# Altium schematic sheet pca10112_sheet2_nrf52840_mcu.SchDoc: nRF52840 MCU
size A3; Organization: Nordic Semiconductor; DocumentNumber: 2; SheetNumber: 2; SheetTotal: 7; CompanyName: Nordic Semiconductor; ProjectName: pca10112.PrjPCB
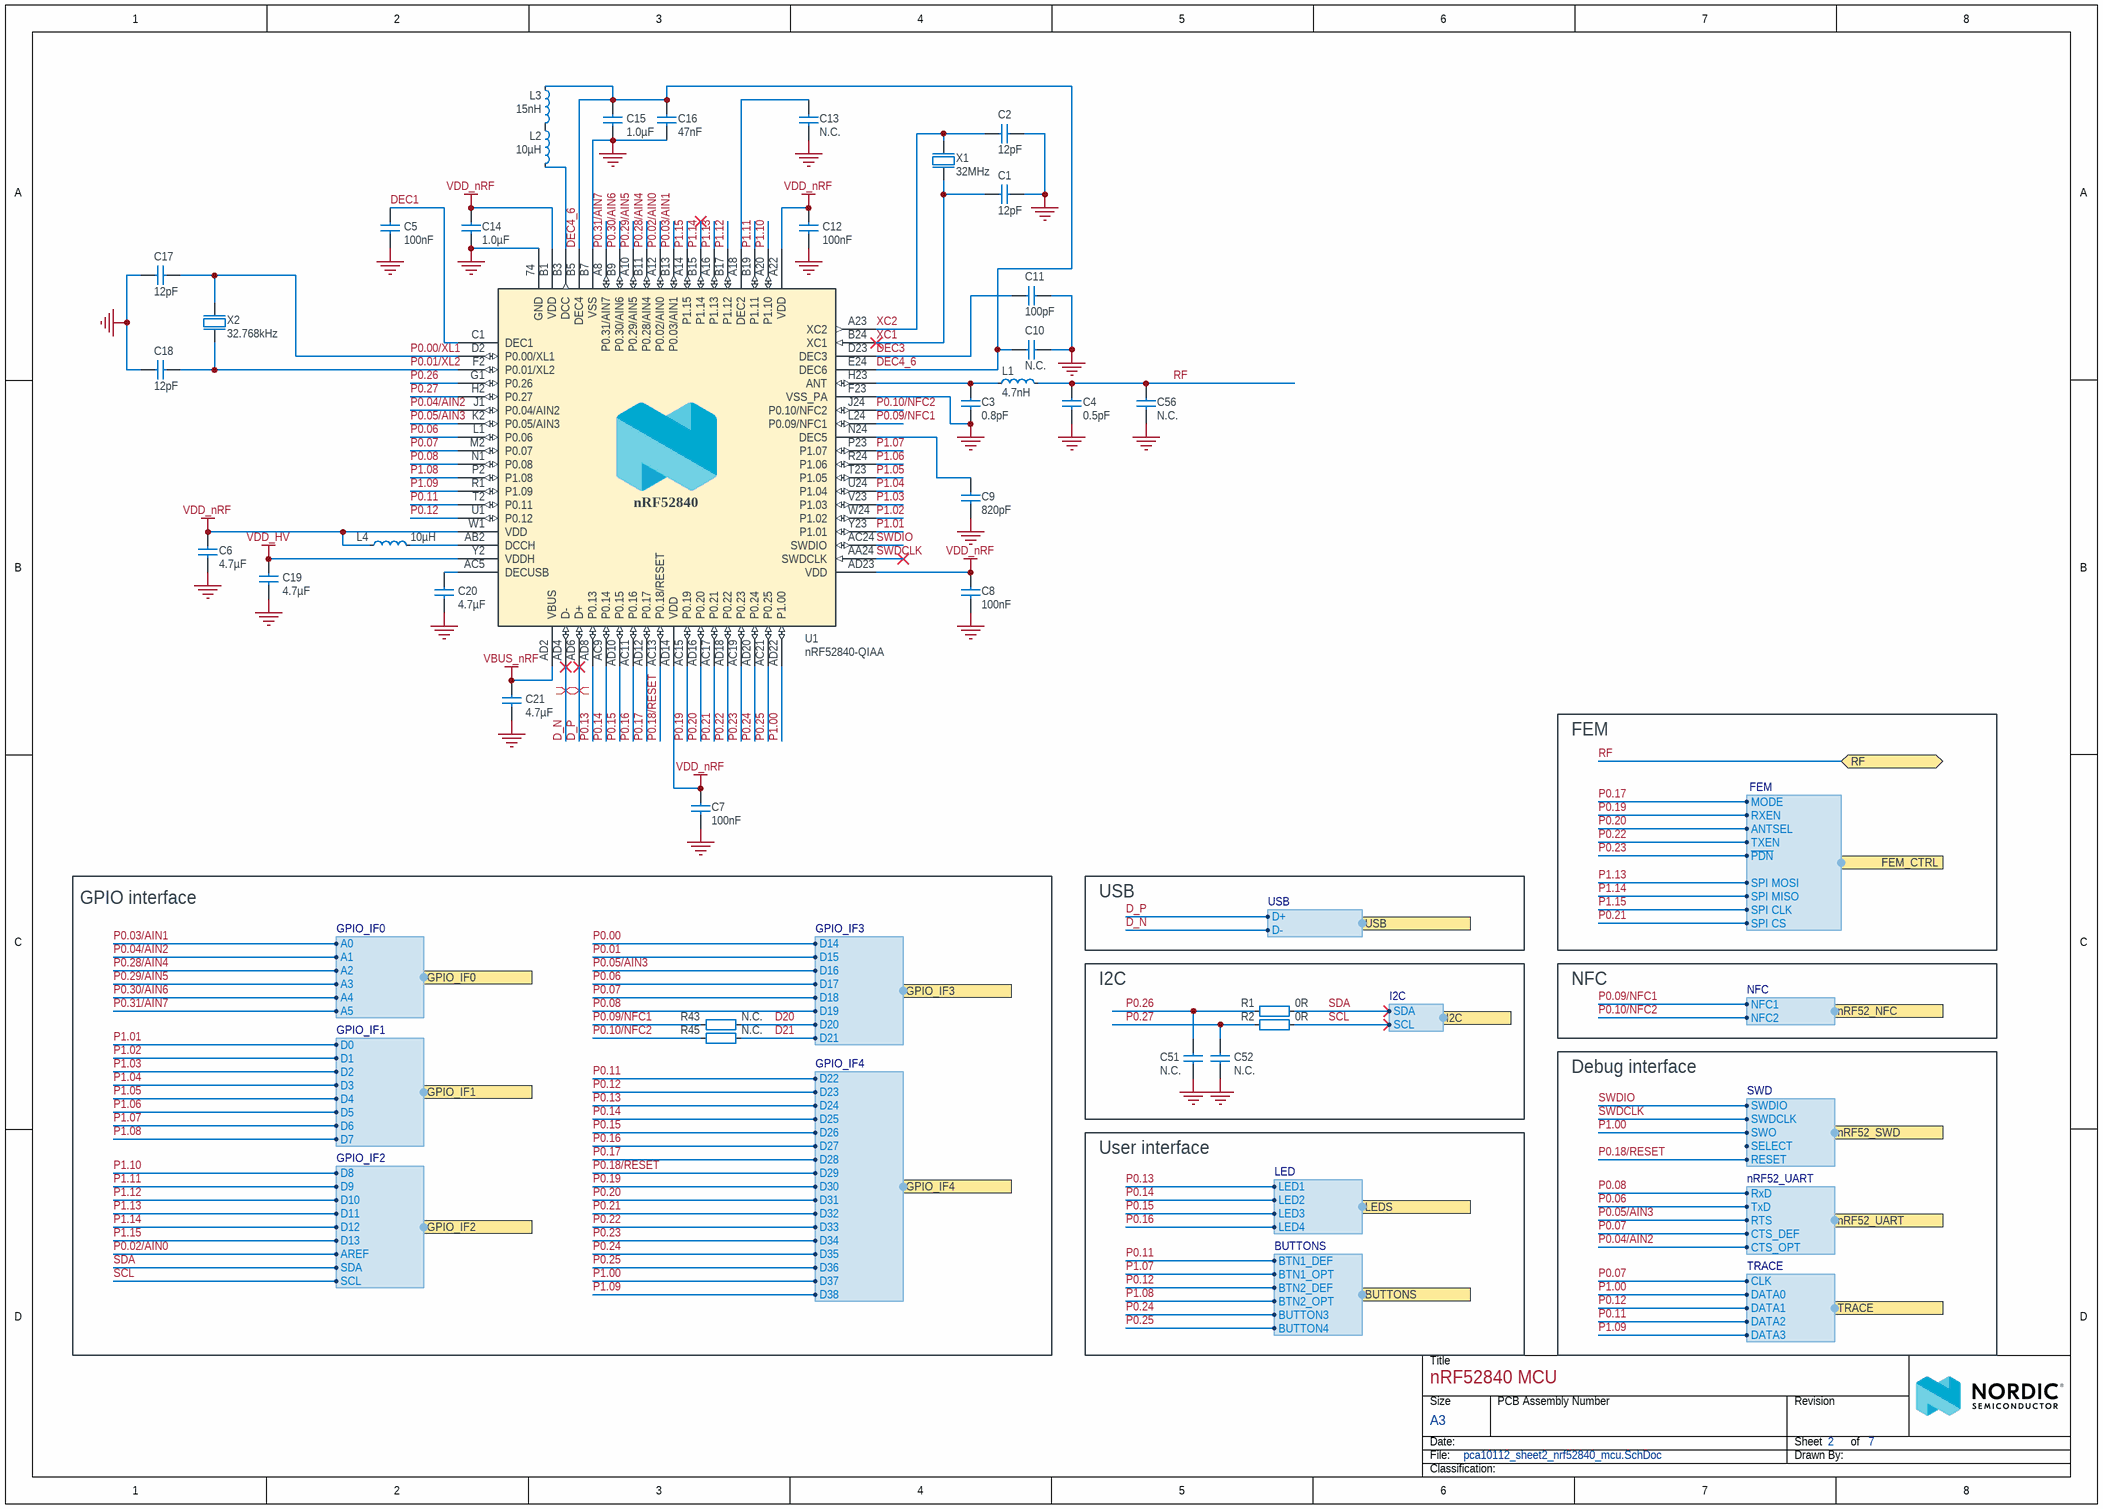
[diagram p0: pca10112_sheet2_nrf52840_mcu.SchDoc]

## Parts
C1  12pF  [CAPC1005X04L]
C2  12pF  [CAPC1005X04L]
C3  0.8pF  [CAPC1005X04L]
C4  0.5pF  [CAPC1005X04L]
C5  100nF  [CAPC1005X04L]
C6  4.7µF  [CAPC1608X06L]
C7  100nF  [CAPC1005X04L]
C8  100nF  [CAPC1005X04L]
C9  820pF  [CAPC1005X04L]
C10  N.C.  [CAPC1005X04L_NC]
C11  100pF  [CAPC1005X04L]
C12  100nF  [CAPC1005X04L]
C13  N.C.  [CAPC1005X04L_NC]
C14  1.0µF  [CAPC1608X06L]
C15  1.0µF  [CAPC1608X06L]
C16  47nF  [CAPC1005X04L]
C17  12pF  [CAPC1005X04L]
C18  12pF  [CAPC1005X04L]
C19  4.7µF  [CAPC1608X06L]
C20  4.7µF  [CAPC1608X06L]
C21  4.7µF  [CAPC1608X06L]
C51  N.C.  [CAPC0603X03L_C_NC]
C52  N.C.  [CAPC0603X03L_C_NC]
C56  N.C.  [CAPC1005X04L_NC]
L1  4.7nH  [INDC1005X04L]
L2  10µH  [INDC1608X06L]
L3  15nH  [INDC1005X04L]
L4  10µH  [INDC1608X06L]
R1  0R  [RESC0603X03L_C]
R2  0R  [RESC0603X03L_C]
R43  N.C.  [RESC1005X04L_NC]
R45  N.C.  [RESC1005X04L_NC]
U1  nRF52840-QIAA  [AQFN50P700X700X85_HS-74N]
X1  32MHz  [BT-XTAL_2016]
X2  32.768kHz  [XTAL_3215]

## Blocks framed on the sheet
GPIO interface: R43 R45
I2C: C51 C52 R1 R2

## Ports
BUTTONS (harness BUTTONS), FEM_CTRL (harness FEM), GPIO_IF0 (harness GPIO_IF0), GPIO_IF1 (harness GPIO_IF1), GPIO_IF2 (harness GPIO_IF2), GPIO_IF3 (harness GPIO_IF3), GPIO_IF4 (harness GPIO_IF4), I2C (harness I2C), LEDS (harness LED), nRF52_NFC (harness NFC), nRF52_SWD (harness SWD), nRF52_UART (harness nRF52_UART), RF (bidir), TRACE (harness TRACE), USB (harness USB)

## Harnesses
GPIO_IF1: D0, D1, D2, D3, D4, D5, D6, D7
GPIO_IF2: D8, D9, D10, D11, D12, D13, AREF, SDA, SCL
GPIO_IF0: A0, A1, A2, A3, A4, A5
GPIO_IF3: D14, D15, D16, D17, D18, D19, D20, D21
GPIO_IF4: D22, D23, D24, D25, D26, D27, D28, D29, D30, D31, D32, D33, D34, D35, D36, D37, D38
I2C: SCL, SDA
SWD: SWDIO, SWDCLK, SWO, RESET, SELECT
TRACE: CLK, DATA0, DATA1, DATA3, DATA2
nRF52_UART: RTS, CTS_DEF, CTS_OPT, TxD, RxD
BUTTONS: BTN2_OPT, BTN2_DEF, BTN1_OPT, BTN1_DEF, BUTTON3, BUTTON4
LED: LED4, LED3, LED2, LED1
USB: D+, D-
NFC: NFC2, NFC1
FEM: MODE, RXEN, ANTSEL, TXEN, ~{PDN}, SPI CLK, SPI MOSI, SPI MISO, SPI CS

## Nets
GND: C1.2 C2.2 C3.1 C4.1 C5.2 C6.2 C7.2 C8.2 C9.2 C10.1 C11.2 C12.2 C13.2 C14.2 C15.1 C16.2 C17.1 C18.1 C19.2 C20.2 C21.2 C51.1 C52.2 C56.2 U1.74(GND) U1.B7(VSS) U1.F23(VSS_PA) X1.2(GND) X1.4(GND)
VBUS_nRF: C21.1 U1.AD2(VBUS)
VDD_HV: C19.1 U1.Y2(VDDH)
VDD_nRF: C6.1 C7.1 C8.1 C12.1 C14.1 L4.1 U1.A22(VDD) U1.AD14(VDD) U1.AD23(VDD) U1.B1(VDD) U1.W1(VDD)
D20: R43.1 ; port GPIO_IF3.D20
D21: R45.1 ; port GPIO_IF3.D21
D_N: U1.AD4(D-) ; port USB.D-
D_P: U1.AD6(D+) ; port USB.D+
DEC1: C5.1 U1.C1(DEC1)
DEC3: C11.1 U1.D23(DEC3)
DEC4_6: C10.2 C15.2 C16.1 L3.1 U1.B5(DEC4) U1.E24(DEC6)
P0.00: port GPIO_IF3.D14
P0.00/XL1: C17.2 U1.D2(P0.00/XL1) X2.1(inp)
P0.01: port GPIO_IF3.D15
P0.01/XL2: C18.2 U1.F2(P0.01/XL2) X2.2(out)
P0.02/AIN0: U1.A12(P0.02/AIN0) ; port GPIO_IF2.AREF
P0.03/AIN1: U1.B13(P0.03/AIN1) ; port GPIO_IF0.A0
P0.04/AIN2: U1.J1(P0.04/AIN2) ; port GPIO_IF0.A1, port nRF52_UART.CTS_OPT
P0.05/AIN3: U1.K2(P0.05/AIN3) ; port GPIO_IF3.D16, port nRF52_UART.RTS
P0.06: U1.L1(P0.06) ; port GPIO_IF3.D17, port nRF52_UART.TxD
P0.07: U1.M2(P0.07) ; port GPIO_IF3.D18, port TRACE.CLK, port nRF52_UART.CTS_DEF
P0.08: U1.N1(P0.08) ; port GPIO_IF3.D19, port nRF52_UART.RxD
P0.09/NFC1: R43.2 U1.L24(P0.09/NFC1) ; port nRF52_NFC.NFC1
P0.10/NFC2: R45.2 U1.J24(P0.10/NFC2) ; port nRF52_NFC.NFC2
P0.11: U1.T2(P0.11) ; port GPIO_IF4.D22, port TRACE.DATA2, port BUTTONS.BTN1_DEF
P0.12: U1.U1(P0.12) ; port GPIO_IF4.D23, port TRACE.DATA1, port BUTTONS.BTN2_DEF
P0.13: U1.AD8(P0.13) ; port GPIO_IF4.D24, port LEDS.LED1
P0.14: U1.AC9(P0.14) ; port GPIO_IF4.D25, port LEDS.LED2
P0.15: U1.AD10(P0.15) ; port GPIO_IF4.D26, port LEDS.LED3
P0.16: U1.AC11(P0.16) ; port GPIO_IF4.D27, port LEDS.LED4
P0.17: U1.AD12(P0.17) ; port GPIO_IF4.D28, port FEM_CTRL.MODE
P0.18/RESET: U1.AC13(P0.18/RESET) ; port GPIO_IF4.D29, port nRF52_SWD.RESET
P0.19: U1.AC15(P0.19) ; port GPIO_IF4.D30, port FEM_CTRL.RXEN
P0.20: U1.AD16(P0.20) ; port GPIO_IF4.D31, port FEM_CTRL.ANTSEL
P0.21: U1.AC17(P0.21) ; port GPIO_IF4.D32, port FEM_CTRL.SPI CS
P0.22: U1.AD18(P0.22) ; port GPIO_IF4.D33, port FEM_CTRL.TXEN
P0.23: U1.AC19(P0.23) ; port GPIO_IF4.D34, port FEM_CTRL.~{PDN}
P0.24: U1.AD20(P0.24) ; port GPIO_IF4.D35, port BUTTONS.BUTTON3
P0.25: U1.AC21(P0.25) ; port GPIO_IF4.D36, port BUTTONS.BUTTON4
P0.26: C51.2 R1.2 U1.G1(P0.26)
P0.27: C52.1 R2.2 U1.H2(P0.27)
P0.28/AIN4: U1.B11(P0.28/AIN4) ; port GPIO_IF0.A2
P0.29/AIN5: U1.A10(P0.29/AIN5) ; port GPIO_IF0.A3
P0.30/AIN6: U1.B9(P0.30/AIN6) ; port GPIO_IF0.A4
P0.31/AIN7: U1.A8(P0.31/AIN7) ; port GPIO_IF0.A5
P1.00: U1.AD22(P1.00) ; port GPIO_IF4.D37, port nRF52_SWD.SWO, port TRACE.DATA0
P1.01: U1.Y23(P1.01) ; port GPIO_IF1.D0
P1.02: U1.W24(P1.02) ; port GPIO_IF1.D1
P1.03: U1.V23(P1.03) ; port GPIO_IF1.D2
P1.04: U1.U24(P1.04) ; port GPIO_IF1.D3
P1.05: U1.T23(P1.05) ; port GPIO_IF1.D4
P1.06: U1.R24(P1.06) ; port GPIO_IF1.D5
P1.07: U1.P23(P1.07) ; port GPIO_IF1.D6, port BUTTONS.BTN1_OPT
P1.08: U1.P2(P1.08) ; port GPIO_IF1.D7, port BUTTONS.BTN2_OPT
P1.09: U1.R1(P1.09) ; port GPIO_IF4.D38, port TRACE.DATA3
P1.10: U1.A20(P1.10) ; port GPIO_IF2.D8
P1.11: U1.B19(P1.11) ; port GPIO_IF2.D9
P1.12: U1.B17(P1.12) ; port GPIO_IF2.D10
P1.13: U1.A16(P1.13) ; port GPIO_IF2.D11, port FEM_CTRL.SPI MOSI
P1.14: U1.B15(P1.14) ; port GPIO_IF2.D12, port FEM_CTRL.SPI MISO
P1.15: U1.A14(P1.15) ; port GPIO_IF2.D13, port FEM_CTRL.SPI CLK
RF: C4.2 C56.1 L1.2 ; port RF
SCL: R2.1 ; port GPIO_IF2.SCL, port I2C.SCL
SDA: R1.1 ; port GPIO_IF2.SDA, port I2C.SDA
SWDCLK: U1.AA24(SWDCLK) ; port nRF52_SWD.SWDCLK
SWDIO: U1.AC24(SWDIO) ; port nRF52_SWD.SWDIO
XC1: C1.1 U1.B24(XC1) X1.1(inp)
XC2: C2.1 U1.A23(XC2) X1.3(out)
NetC3_2: C3.2 L1.1 U1.H23(ANT)
NetC9_1: C9.1 U1.N24(DEC5)
NetC13_1: C13.1 U1.A18(DEC2)
NetC20_1: C20.1 U1.AC5(DECUSB)
NetL2_1: L2.1 L3.2
NetL2_2: L2.2 U1.B3(DCC)
NetL4_2: L4.2 U1.AB2(DCCH)

## Layout directives
differential pair: D_N, D_P

## Notes on the sheet
- FEM
- USB
- NFC
- Debug interface
- User interface
- Title
- Size
- Date:
- File:
- A3
- PCB Assembly Number
- Sheet         of
- Drawn By:
- Revision
- Classification:
- (in symbol nRF52840-QIAAF0) nRF52840

## Library data of the parts
C1 C2 C17 C18 = C0402-12p: Capacitor, NP0, ±2%; Manufacturer: N.A.; Part number IPS: 00000002398; Part number NEMS: 100200137; Note: 50V; Artikkelnr Noca: 20029159; Pad Count: 2; Component Status: Active; Part Number: C0402-12p; LatestRevisionDate: 2011-05-11; Published: 2009-05-08; Value: 12pF; Footprint Doc: 0402; Manufacturer Part Number: N.A.; ComponentLink1URL: N.A.; ComponentLink1Description: Datasheet; ComponentLink2URL: N.A.; ComponentLink2Description: Supplier link; HelpURL: N.A.; Supplier 1: N.A.; Supplier Part Number 1: N.A.; Supplier 2: N.A.; Supplier Part Number 2: N.A.; Component Class: Capacitors; PartId: 100200137; Author: rsk; Part number Norautron: N.A.
C3 = C0402-0.8p: Capacitor, NP0, ±5%; Manufacturer: Murata; Manufacturer Part Number: GRM1555C1HR80WA01D; Part number IPS: 00000007782; Part number Norautron: N.A.; Part number NEMS: 100200116; Note: 50V; Artikkelnr Noca: 20029147; Pad Count: 2; Component Status: Active; Part Number: C0402-0.8p; LatestRevisionDate: 2012-11-21; Published: 2009-05-08; Value: 0.8pF; Footprint Doc: 0402; ComponentLink1URL: https://www.murata.com/~/media/webrenewal/support/library/catalog/products/capacitor/mlcc/c02e.ashx?la=en-us; ComponentLink1Description: Datasheet; ComponentLink2URL: N.A.; ComponentLink2Description: Supplier link; HelpURL: N.A.; Supplier 1: Digi-Key; Supplier Part Number 1: 490-6270-1-ND; Supplier 2: N.A.; Supplier Part Number 2: N.A.; Component Class: Capacitors; PartId: 100200116; Author: rsk
C4 = C0402-0.5p: Capacitor, C0G, ±0.05pF, 50V; Manufacturer: Murata; Manufacturer Part Number: GJM1555C1HR50WB01; Part number IPS: 00000004293; Part number Norautron: N.A.; Part number NEMS: 100200112; Artikkelnr Noca: 20020007; Pad Count: 2; Component Status: Active; Part Number: C0402-0.5p; LatestRevisionDate: 2020-10-13; Published: 2009-05-08; Value: 0.5pF; Note: 50V; Footprint Doc: 0402; ComponentLink1URL: N.A.; ComponentLink1Description: Datasheet; ComponentLink2URL: N.A.; ComponentLink2Description: Supplier link; HelpURL: N.A.; Supplier 1: Digi-Key; Supplier Part Number 1: 490-11250-1-ND; Supplier 2: N.A.; Supplier Part Number 2: N.A.; Component Class: Capacitors; PartId: 100200112; Author: rsk
C5 C7 C8 C12 = C0402-100n: Capacitor, X7R, ±10%; Manufacturer: N.A.; Part number IPS: 00000005296; Part number NEMS: 100200184; Note: 16V; Artikkelnr Noca: 20039200; Pad Count: 2; Component Status: Active; Part Number: C0402-100n; LatestRevisionDate: 2009-11-23; Published: 2009-05-08; Value: 100nF; Footprint Doc: 0402; Manufacturer Part Number: N.A.; ComponentLink1URL: N.A.; ComponentLink1Description: Datasheet; ComponentLink2URL: N.A.; ComponentLink2Description: Supplier link; HelpURL: N.A.; Supplier 1: N.A.; Supplier Part Number 1: N.A.; Supplier 2: N.A.; Supplier Part Number 2: N.A.; Component Class: Capacitors; PartId: 100200184; Author: rsk; Part number Norautron: N.A.
C6 C20 = C0603-4µ7-6.3V-X7R: Capacitor, X7R, ±10%, 6.3V; Manufacturer: Samsung Electro-Mechanics America; Manufacturer Part Number: CL10B475KQ8NQNC; Part number IPS: 00000002541; Part number Norautron: N.A.; Part number NEMS: 100200350; Artikkelnr Noca: 20039473; Pad Count: 2; Component Status: Active; Part Number: C0603-4µ7-6.3V-X7R; LatestRevisionDate: 2015-06-10; Published: 2015-06-10; Value: 4.7µF; Note: 6.3V; Footprint Doc: 0603; ComponentLink1URL: N.A.; ComponentLink1Description: Datasheet; ComponentLink2URL: N.A.; ComponentLink2Description: Supplier link; HelpURL: http://media.digikey.com/pdf/Data%20Sheets/Samsung%20PDFs/CL10B475KQ8NQNC_Spec.pdf; Supplier 1: Digi-Key; Supplier Part Number 1: 1276-2087-1-ND; Supplier 2: N.A.; Supplier Part Number 2: N.A.; Component Class: Capacitors; PartId: 100200350; Author: rsk
C9 = C0402-820p: Capacitor, NP0, ±5%, 50V; Manufacturer: N.A.; Part number IPS: 00000004365; Part number NEMS: 100200161; Artikkelnr Noca: 20029219; Pad Count: 2; Component Status: Active; Part Number: C0402-820p; LatestRevisionDate: 2020-10-13; Published: 2009-05-08; Value: 820pF; Note: 50V; Footprint Doc: 0402; Manufacturer Part Number: N.A.; ComponentLink1URL: N.A.; ComponentLink1Description: Datasheet; ComponentLink2URL: N.A.; ComponentLink2Description: Supplier link; HelpURL: N.A.; Supplier 1: N.A.; Supplier Part Number 1: N.A.; Supplier 2: N.A.; Supplier Part Number 2: N.A.; Component Class: Capacitors; PartId: 100200161; Author: rsk; Part number Norautron: N.A.
C10 C13 C56 = C0402-N.C.: Not mounted; Manufacturer: N.A.; Part number NEMS: 100200105; Note: Chip Cap; Assembly: Not mounted; Pad Count: 2; Component Status: Active; Part Number: C0402-N.C.; LatestRevisionDate: 2009-05-08; Published: 2009-05-08; Value: N.C.; Footprint Doc: 0402; Manufacturer Part Number: N.A.; Artikkelnr Noca: N.A.; Part number IPS: N.A.; ComponentLink1URL: N.A.; ComponentLink1Description: Datasheet; ComponentLink2URL: N.A.; ComponentLink2Description: Supplier link; HelpURL: N.A.; Supplier 1: N.A.; Supplier Part Number 1: N.A.; Supplier 2: N.A.; Supplier Part Number 2: N.A.; Component Class: Capacitors; PartId: 100200105; Author: rsk; Part number Norautron: N.A.
C11 = C0402-100p: Capacitor, NP0, ±5%; Manufacturer: N.A.; Part number IPS: 00000002361; Part number NEMS: 100200148; Note: 50V; Artikkelnr Noca: 20029135; Pad Count: 2; Component Status: Active; Part Number: C0402-100p; LatestRevisionDate: 2009-05-08; Published: 2009-05-08; Value: 100pF; Footprint Doc: 0402; Manufacturer Part Number: N.A.; ComponentLink1URL: N.A.; ComponentLink1Description: Datasheet; ComponentLink2URL: N.A.; ComponentLink2Description: Supplier link; HelpURL: N.A.; Supplier 1: N.A.; Supplier Part Number 1: N.A.; Supplier 2: N.A.; Supplier Part Number 2: N.A.; Component Class: Capacitors; PartId: 100200148; Author: rsk; Part number Norautron: N.A.
C14 C15 = C0603-1µ0: Capacitor, X7R, ±10%; Manufacturer: N.A.; Part number IPS: 00000000616; Part number Norautron: 262083409; Part number NEMS: 100200271; Note: 16V; Artikkelnr Noca: 20039282; Pad Count: 2; Component Status: Active; Part Number: C0603-1µ0; LatestRevisionDate: 2013-06-05; Published: 2009-05-08; Value: 1.0µF; Footprint Doc: 0603; Manufacturer Part Number: N.A.; ComponentLink1URL: N.A.; ComponentLink1Description: Datasheet; ComponentLink2URL: N.A.; ComponentLink2Description: Supplier link; HelpURL: N.A.; Supplier 1: N.A.; Supplier Part Number 1: N.A.; Supplier 2: N.A.; Supplier Part Number 2: N.A.; Component Class: Capacitors; PartId: 100200271; Author: rsk
C16 = C0402-47n: Capacitor, X7R, ±10%, 25V; Manufacturer: N.A.; Part number IPS: 00000003143; Part number NEMS: 100200180; Note: Chip Cap 10%; Artikkelnr Noca: 20039389; Pad Count: 2; Component Status: Active; Part Number: C0402-47n; LatestRevisionDate: 2020-10-13; Published: 2009-05-08; Value: 47nF; Footprint Doc: 0402; Manufacturer Part Number: N.A.; ComponentLink1URL: N.A.; ComponentLink1Description: Datasheet; ComponentLink2URL: N.A.; ComponentLink2Description: Supplier link; HelpURL: N.A.; Supplier 1: N.A.; Supplier Part Number 1: N.A.; Supplier 2: N.A.; Supplier Part Number 2: N.A.; Component Class: Capacitors; PartId: 100200180; Author: rsk; Part number Norautron: N.A.
C19 C21 = C0603-4µ7-10V-X7S: Capacitor, X7S, ±10%, 10V; Manufacturer: N.A.; Part number IPS: 00000001779; Part number NEMS: 100200351; Artikkelnr Noca: 20030013; Pad Count: 2; Component Status: Active; Part Number: C0603-4µ7-10V-X7S; LatestRevisionDate: 2016-08-15; Published: 2016-08-15; Value: 4.7µF; Note: 10V; Footprint Doc: 0603; Manufacturer Part Number: N.A.; ComponentLink1URL: N.A.; ComponentLink1Description: Datasheet; ComponentLink2URL: N.A.; ComponentLink2Description: Supplier link; HelpURL: N.A.; Supplier 1: Digi-Key; Supplier Part Number 1: 445-14258-1-ND; Supplier 2: N.A.; Supplier Part Number 2: N.A.; Component Class: Capacitors; PartId: 100200351; Author: rsk; Part number Norautron: N.A.
C51 C52 = C0201-N.C.: Not mounted; Manufacturer: N.A.; Part number NEMS: 100200001; Assembly: Not mounted; Note: Chip Cap; Pad Count: 2; Component Status: Active; Part Number: C0201-N.C.; Manufacturer Part Number: N.A.; Footprint Doc: 0201; LatestRevisionDate: 2014-11-13; Published: 2014-11-13; Value: N.C.; Artikkelnr Noca: N.A.; Part number IPS: N.A.; ComponentLink1URL: N.A.; ComponentLink1Description: Datasheet; ComponentLink2URL: N.A.; ComponentLink2Description: Supplier link; HelpURL: N.A.; Supplier 1: N.A.; Supplier Part Number 1: N.A.; Supplier 2: N.A.; Supplier Part Number 2: N.A.; Component Class: Capacitors; PartId: 100200001; Author: rsk; Part number Norautron: N.A.
L1 = L0402-4n7-LQG15HS4N7B02D: Inductor, 700mA, ±0.1nH, 160mR LQG; Manufacturer: Murata; Part number NEMS: 100300410; Note: High frequency chip inductor ±5%; Artikkelnr Noca: N.A.; Pad Count: 2; Component Status: Active; Part Number: L0402-4n7-LQG15HS4N7B02D; LatestRevisionDate: 2022-02-09; Published: 2022-02-09; Value: 4.7nH; Footprint Doc: 0402; Manufacturer Part Number: LQG15HS4N7B02D; ComponentLink1Description: Datasheet; ComponentLink2Description: Supplier link; Part number IPS: N.A.; ComponentLink1URL: N.A.; ComponentLink2URL: N.A.; HelpURL: https://search.murata.co.jp/Ceramy/image/img/P02/JELF243B-0010.pdf; Supplier 1: Digi-Key; Supplier Part Number 1: 490-LQG15HS4N7B02DTR-ND; Supplier 2: Mouser; Supplier Part Number 2: 81-LQG15HS4N7B02D; Component Class: Inductors; PartId: 100300410; Author: stl1; Part number Norautron: N.A.
L2 = L0603-10µ-TDK: Inductor, 250mA, ±20%, 1.05ohm. -55°C ~ 125°C; Manufacturer: TDK Corporation; Manufacturer Part Number: MLZ1608M100WTD25; Part number Norautron: 26521771; Part number NEMS: 100300079; Note: N.A.; Pad Count: 2; Component Status: Active; Part Number: L0603-10µ-TDK; LatestRevisionDate: 2012-09-19; Published: 2019-05-06; Value: 10µH; Footprint Doc: 0603; ComponentLink1Description: Datasheet; ComponentLink2Description: Supplier link; Artikkelnr Noca: N.A.; Part number IPS: N.A.; ComponentLink1URL: N.A.; ComponentLink2URL: N.A.; HelpURL: https://product.tdk.com/info/en/catalog/datasheets/inductor_automotive_decoupling_mlz1608_en.pdf; Supplier 1: Digi-Key; Supplier Part Number 1: 445-175588-1-ND; Supplier 2: Mouser; Supplier Part Number 2: 810-MLZ1608M100WTD25; Component Class: Inductors; PartId: 100300079; Author: rsk
L3 = L0402-15n-LQG15HS15NJ02D: Inductor, 450mA, ±5%,  0.32ohm; Manufacturer: Murata; Part number NEMS: 100300412; Note: High frequency chip inductor ±5%; Artikkelnr Noca: N.A.; Pad Count: 2; Component Status: Active; Part Number: L0402-15n-LQG15HS15NJ02D; LatestRevisionDate: 2022-02-10; Published: 2022-02-10; Value: 15nH; Footprint Doc: 0402; Manufacturer Part Number: LQG15HS15NJ02D; ComponentLink1Description: Datasheet; ComponentLink2Description: Supplier link; Part number IPS: N.A.; ComponentLink1URL: N.A.; ComponentLink2URL: N.A.; HelpURL: https://no.mouser.com/datasheet/2/281/1/JELF243B_0010-1699614.pdf; Supplier 1: Digi-Key; Supplier Part Number 1: 490-2625-2-ND; Supplier 2: Mouser; Supplier Part Number 2: 81-LQG15HS15NJ02D; Component Class: Inductors; PartId: 100300412; Author: stl1; Part number Norautron: N.A.
L4 = L0603-10µ: Inductor, 80mA, ±10%; Manufacturer: Taiyo Yuden; Manufacturer Part Number: LBMF1608T100K; Part number IPS: 00000007794; Part number Norautron: N.A.; Part number NEMS: 100300078; Note: LBMF1608T100K 10µH 80mA 0603; Artikkelnr Noca: 33029314; Pad Count: 2; Component Status: Active; Part Number: L0603-10µ; LatestRevisionDate: 2012-09-19; Published: 2010-02-24; Value: 10µH; Footprint Doc: 0603; ComponentLink1Description: Datasheet; ComponentLink2Description: Supplier link; ComponentLink1URL: N.A.; ComponentLink2URL: N.A.; HelpURL: http://www.yuden.co.jp/ut/product/pdf/elb2_e.pdf; Supplier 1: Digi-Key; Supplier Part Number 1: 587-1714-1-ND; Supplier 2: Farnell; Supplier Part Number 2: 178-6105; Component Class: Inductors; PartId: 100300078; Author: rsk
R1 R2 = R0201-0R: Resistor, ±5%, 0.05W; Manufacturer: N.A.; Part number IPS: 00000003245; Part number NEMS: 100100001; Note: Chip Res 5%; Pad Count: 2; Component Status: Active; Part Number: R0201-0R; Manufacturer Part Number: N.A.; Footprint Doc: 0201; LatestRevisionDate: 2017-11-09; Published: 2014-11-13; Value: 0R; Artikkelnr Noca: N.A.; ComponentLink1URL: N.A.; ComponentLink1Description: Datasheet; ComponentLink2URL: N.A.; ComponentLink2Description: Supplier link; HelpURL: N.A.; Supplier 1: N.A.; Supplier Part Number 1: N.A.; Supplier 2: N.A.; Supplier Part Number 2: N.A.; Component Class: Resistors; PartId: 100100001; Author: rsk; Part number Norautron: N.A.
R43 R45 = R0402-N.C.: Not mounted; Manufacturer: N.A.; Part number NEMS: 100100281; Note: Chip Res; Assembly: Not mounted; Pad Count: 2; Component Status: Active; Part Number: R0402-N.C.; Manufacturer Part Number: N.A.; Footprint Doc: 0402; LatestRevisionDate: 2009-05-08; Published: 2009-05-08; Value: N.C.; Artikkelnr Noca: N.A.; Part number IPS: N.A.; ComponentLink1URL: N.A.; ComponentLink1Description: Datasheet; ComponentLink2URL: N.A.; ComponentLink2Description: Supplier link; HelpURL: N.A.; Supplier 1: N.A.; Supplier Part Number 1: N.A.; Supplier 2: N.A.; Supplier Part Number 2: N.A.; Component Class: Resistors; PartId: 100100281; Author: rsk; Part number Norautron: N.A.
U1 = nRF52840-QIAAF0: Multi-protocol Bluetooth Low Energy, IEEE 802.15.4, ANT and 2.4GHz proprietary system-on-chip; Manufacturer: Nordic Semiconductor; Part number IPS: 80000002377; Part number NEMS: 102000222; Artikkelnr Noca: N.A.; Pad Count: 73; Component Status: Active; Author: hany; Component Class: nRF_Devices; ComponentLink1Description: Datasheet; ComponentLink1URL: N.A.; ComponentLink2Description: Supplier link; ComponentLink2URL: N.A.; Footprint Doc: AQFN-73; HelpURL: N.A.; LatestRevisionDate: 2021-03-24; Manufacturer Part Number: nRF52840-QIAAF0; Note: N.A.; Part number Norautron: N.A.; Published: 2021-03-24; Supplier 1: Nordic Semiconductor; Supplier 2: N.A.; Supplier Part Number 1: nRF52840-QIAAF0; Supplier Part Number 2: N.A.; Value: nRF52840-QIAA; Part Number: nRF52840-QIAAF0; PartId: 102000222
X1 = XTAL_SMD2016_32MHz_8pF_Golledge: XTAL SMD 2016, 32MHz, Cl=8pF, Tol: ±10ppm, Stab: ±15ppm; Manufacturer Part Number: MP06003; Part number IPS: 00000001431; Part number Norautron: N.A.; Part number NEMS: 101600041; Note: XTAL SMD 32.000MHz; Artikkelnr Noca: 22010050; Pad Count: 4; Component Status: Active; Part Number: XTAL_SMD2016_32MHz_8pF_Golledge; LatestRevisionDate: 2016-11-02; Published: 2016-11-02; Value: 32MHz; Footprint Doc: XTAL_2016; Manufacturer: Golledge; ComponentLink1URL: N.A.; ComponentLink1Description: Datasheet; ComponentLink2URL: N.A.; ComponentLink2Description: Supplier link; HelpURL: \\hizz\pro\app9717\Datasheet\crystals\Golledge\mp06003.pdf; Supplier 1: Link Nordic; Supplier Part Number 1: N.A.; Supplier 2: N.A.; Supplier Part Number 2: N.A.; Component Class: Oscillators; PartId: 101600041; Author: rsk
X2 = XTAL_SMD3215_32.768kHz_9pF_NDK: XTAL SMD 3215, 32.768kHz, 9pF, ±20ppm; Manufacturer: NDK; Manufacturer Part Number: NX3215SA-32.768K-STD-MUA-9; Part number IPS: 00000005419; Part number Norautron: N.A.; Part number NEMS: 101600019; Note: XTAL SMD 32.768kHz; Artikkelnr Noca: 22010049; Pad Count: 2; Component Status: Active; Part Number: XTAL_SMD3215_32.768kHz_9pF_NDK; LatestRevisionDate: 2017-10-23; Published: 2017-10-23; Value: 32.768kHz; Footprint Doc: XTAL_3215; ComponentLink1URL: N.A.; ComponentLink1Description: Datasheet; ComponentLink2URL: N.A.; ComponentLink2Description: Supplier link; HelpURL: N.A.; Supplier 1: N.A.; Supplier Part Number 1: N.A.; Supplier 2: N.A.; Supplier Part Number 2: N.A.; Component Class: Oscillators; PartId: 101600019; Author: rsk